# Altium schematic sheet pH_Orp_Board.SchDoc: pH_Orp_Board
size A4; Organization: Denis LAFOURCADE; Address1: Clos de Lardenne; Address2: 3, rue de la Catalogne; Address3: 31170; Address4: TOURNEFEUILLE; DocumentNumber: 0; Revision: 2; SheetNumber: 1; SheetTotal: 1
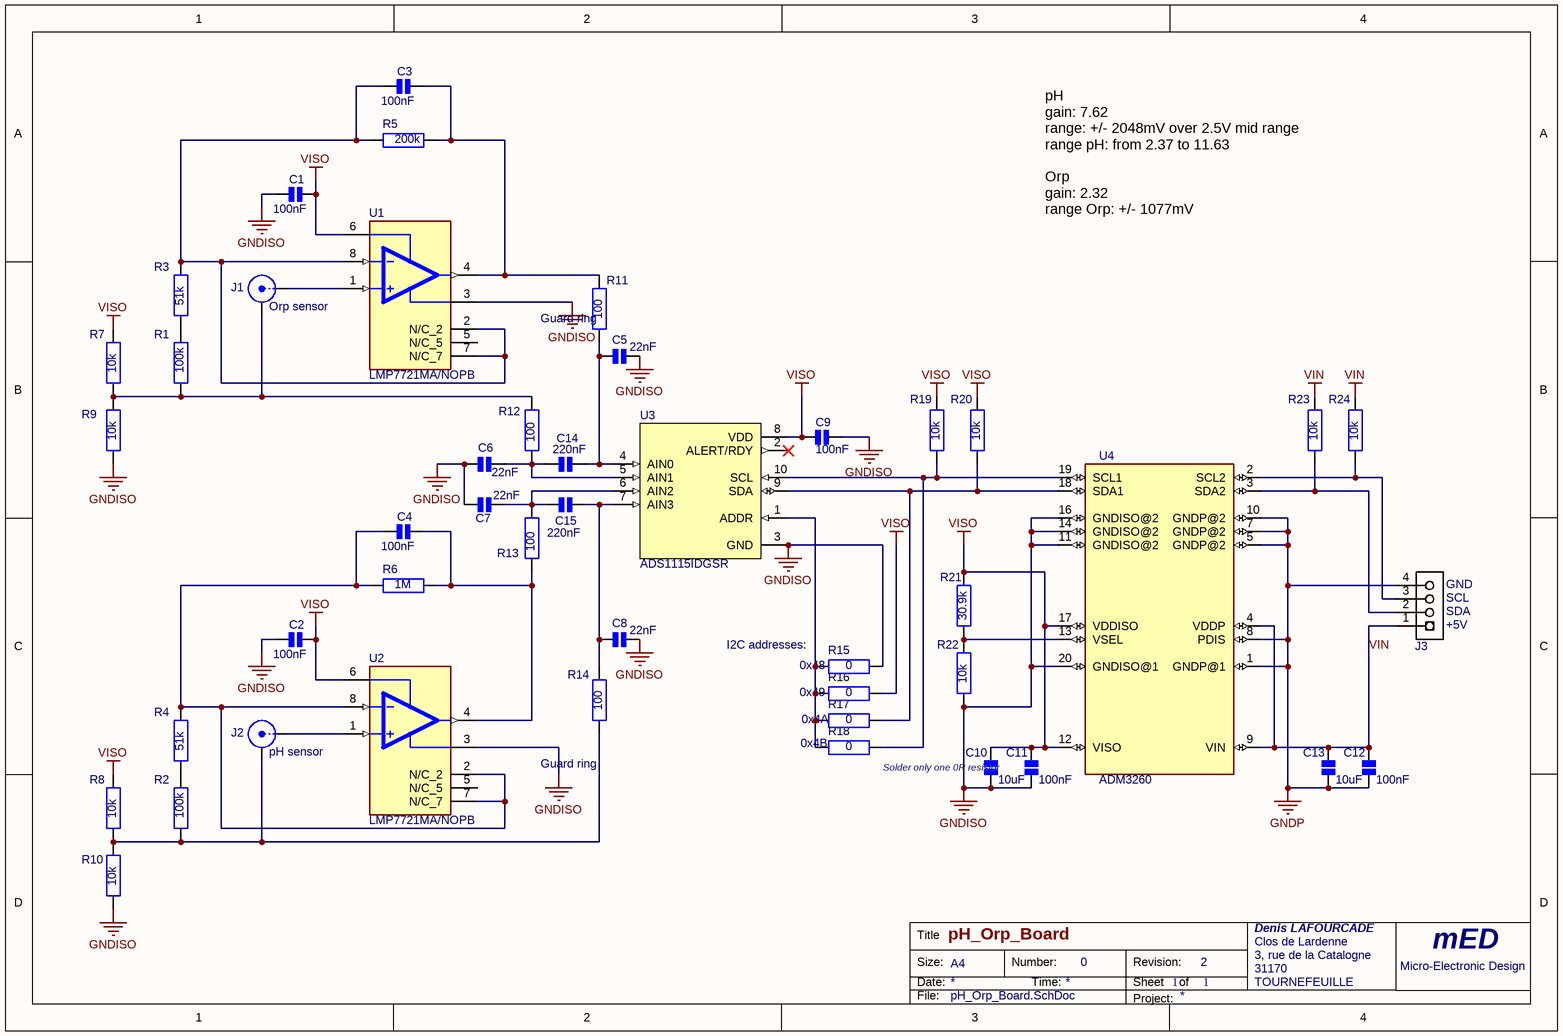
[diagram p0: pH_Orp_Board.SchDoc]

## Parts
C1  100nF  [0805C-GENERIC]
C2  100nF  [0805C-GENERIC]
C3  100nF  [0805C-GENERIC]
C4  100nF  [0805C-GENERIC]
C5  22nF  [0805C-GENERIC]
C6  22nF  [0805C-GENERIC]
C7  22nF  [0805C-GENERIC]
C8  22nF  [0805C-GENERIC]
C9  100nF  [0805C-GENERIC]
C10  10uF  [0805C-GENERIC]
C11  100nF  [0805C-GENERIC]
C12  100nF  [0805C-GENERIC]
C13  10uF  [0805C-GENERIC]
C14  220nF  [0805C-GENERIC]
C15  220nF  [0805C-GENERIC]
J1  Orp sensor  [BNC_RA CON]
J2  pH sensor  [BNC_RA CON]
J3  HEADER-1X4  [HEADER-1X4]  (value not drawn)
R1  100k  [0805R-100K]
R2  100k  [0805R-100K]
R3  51k  [0805R-56K]
R4  51k  [0805R-56K]
R5  200k  [0805R-220K]
R6  1M  [0805R-TBD]
R7  10k  [0805R-10K]
R8  10k  [0805R-10K]
R9  10k  [0805R-10K]
R10  10k  [0805R-10K]
R11  100  [0805R-100]
R12  100  [0805R-100]
R13  100  [0805R-100]
R14  100  [0805R-100]
R15  0  [0805R-0R1]
R16  0  [0805R-0R1]
R17  0  [0805R-0R1]
R18  0  [0805R-0R1]
R19  10k  [0805R-10K]
R20  10k  [0805R-10K]
R21  30.9k  [0805R-33K]
R22  10k  [0805R-10K]
R23  10k  [0805R-10K]
R24  10k  [0805R-10K]
U1  LMP7721MA/NOPB  [SOIC127P599X175-8N]
U2  LMP7721MA/NOPB  [SOIC127P599X175-8N]
U3  ADS1115IDGSR  [SOP50P490X110-10N]
U4  ADM3260  [SOP65P780X200-20N]

## Nets
GNDISO: C1.1 C2.1 C5.2 C6.1 C7.1 C8.2 C9.2 C10.2 C11.2 R9.1 R10.1 R15.2 R22.1 U1.3(V-) U2.3(V-) U3.3(GND) U4.11(GNDISO@2) U4.14(GNDISO@2) U4.16(GNDISO@2) U4.20(GNDISO@1)
GNDP: C12.2 C13.2 J3.4 U4.1(GNDP@1) U4.5(GNDP@2) U4.7(GNDP@2) U4.8(PDIS) U4.10(GNDP@2)
VIN: C12.1 C13.1 J3.1 R23.2 R24.2 U4.4(VDDP) U4.9(VIN)
VISO: C1.2 C2.2 C9.1 C10.1 C11.1 R7.2 R8.2 R16.2 R19.2 R20.2 R21.2 U1.6(V+) U2.6(V+) U3.8(VDD) U4.12(VISO) U4.17(VDDISO)
NetC3_1: C3.1 R3.2 R5.2 U1.2(N/C_2) U1.7(N/C_7) U1.8(IN-)
NetC3_2: C3.2 R5.1 R11.2 U1.4(VOUT)
NetC4_1: C4.1 R4.2 R6.2 U2.2(N/C_2) U2.7(N/C_7) U2.8(IN-)
NetC4_2: C4.2 R6.1 R13.2 U2.4(VOUT)
NetC5_1: C5.1 C14.2 R11.1 U3.4(AIN0)
NetC6_2: C6.2 C14.1 R12.2 U3.5(AIN1)
NetC7_2: C7.2 C15.1 R13.1 U3.6(AIN2)
NetC8_1: C8.1 C15.2 R14.2 U3.7(AIN3)
NetJ1_1: J1.1(X) U1.1(IN+)
NetJ1_2: J1.2(Y) R1.1 R7.1 R9.2 R12.1
NetJ2_1: J2.1(X) U2.1(IN+)
NetJ2_2: J2.2(Y) R2.1 R8.1 R10.2 R14.1
NetJ3_2: J3.2 R23.1 U4.3(SDA2)
NetJ3_3: J3.3 R24.1 U4.2(SCL2)
NetR1_2: R1.2 R3.1
NetR2_2: R2.2 R4.1
NetR15_1: R15.1 R16.1 R17.1 R18.1 U3.1(ADDR)
NetR17_2: R17.2 R20.1 U3.9(SDA) U4.18(SDA1)
NetR18_2: R18.2 R19.1 U3.10(SCL) U4.19(SCL1)
NetR21_1: R21.1 R22.2 U4.13(VSEL)

Not connected (* = marked no-connect by the designer): U1 5(N/C_5); U2 5(N/C_5); U3 2(ALERT/RDY)*

## Notes on the sheet
- pH
  gain: 7.62
  range: +/- 2048mV over 2.5V mid range
  range pH: from 2.37 to 11.63
  Orp
  gain: 2.32
  range Orp: +/- 1077mV
- (near U1) Guard ring
- (near R15) I2C addresses:
- (near J3) GND
- (near J3) SDA
- (near J3) SCL
- (near J3) +5V
- 0x49
- 0x48
- (near U2) Guard ring
- 0x4B
- 0x4A
- (near R18) Solder only one 0R resistor
- Title
- Size:
- Date:
- A4
- Number:
- Time:
- Revision:
- Sheet
- of
- Micro-Electronic Design
- mED
- File:
- Project:

## Library data of the parts
C1-C15 = CAP: Capacitor
J1 J2 = BNC: BNC Elbow Connector; LatestRevisionDate: 17-Jul-2002; LatestRevisionNote: Re-released for DXP Platform.; Publisher: Altium Limited
R1-R24 = RES2: Resistor
U1 U2 = LMP7721MA/NOPB: 3 Femtoampere Input Bias Current Precision Amplifier 8-SOIC -40 to 125; MF: Texas Instruments; Purchase-URL: https://pricing.snapeda.com/search/part/LMP7721MA/NOPB/?ref=eda; Package: SOIC-8 Texas Instruments; MP: LMP7721MA/NOPB; Price: None; Availability: Good; Value: *; Check_prices: https://www.snapeda.com/parts/LMP7721MA/NOPB/Texas%20Instruments/view-part/2634971/?ref=eda; SnapEDA_Link: https://www.snapeda.com/parts/LMP7721MA/NOPB/Texas%20Instruments/view-part/2634971/?ref=snap
U3 = ADS1115IDGSR: MP: altium_native_batch; Package: None; Price: None; Availability: Unavailable; Value: *
U4 = ADM3260: IÂ²C Digital Isolator 2500Vrms 2 Channel - 25kV/Âµs CMTI 20-SSOP (0.209, 5.30mm Width); MF: Analog Devices; Package: SSOP-20 Analog Devices; Check_prices: https://www.snapeda.com/parts/ADM3260/Analog+Devices+Inc./view-part/?ref=eda; Value: *; SnapEDA_Link: https://www.snapeda.com/parts/ADM3260/Analog+Devices+Inc./view-part/?ref=snap; Availability: In Stock; MP: ADM3260; Price: None
J3 = HEADER-1X4: Supplier 1: Digi-Key; Supplier Part Number 1: S1011E-36-ND